# EAGLE schematic LorRaBaseBoard (EAGLE 9.6.2)
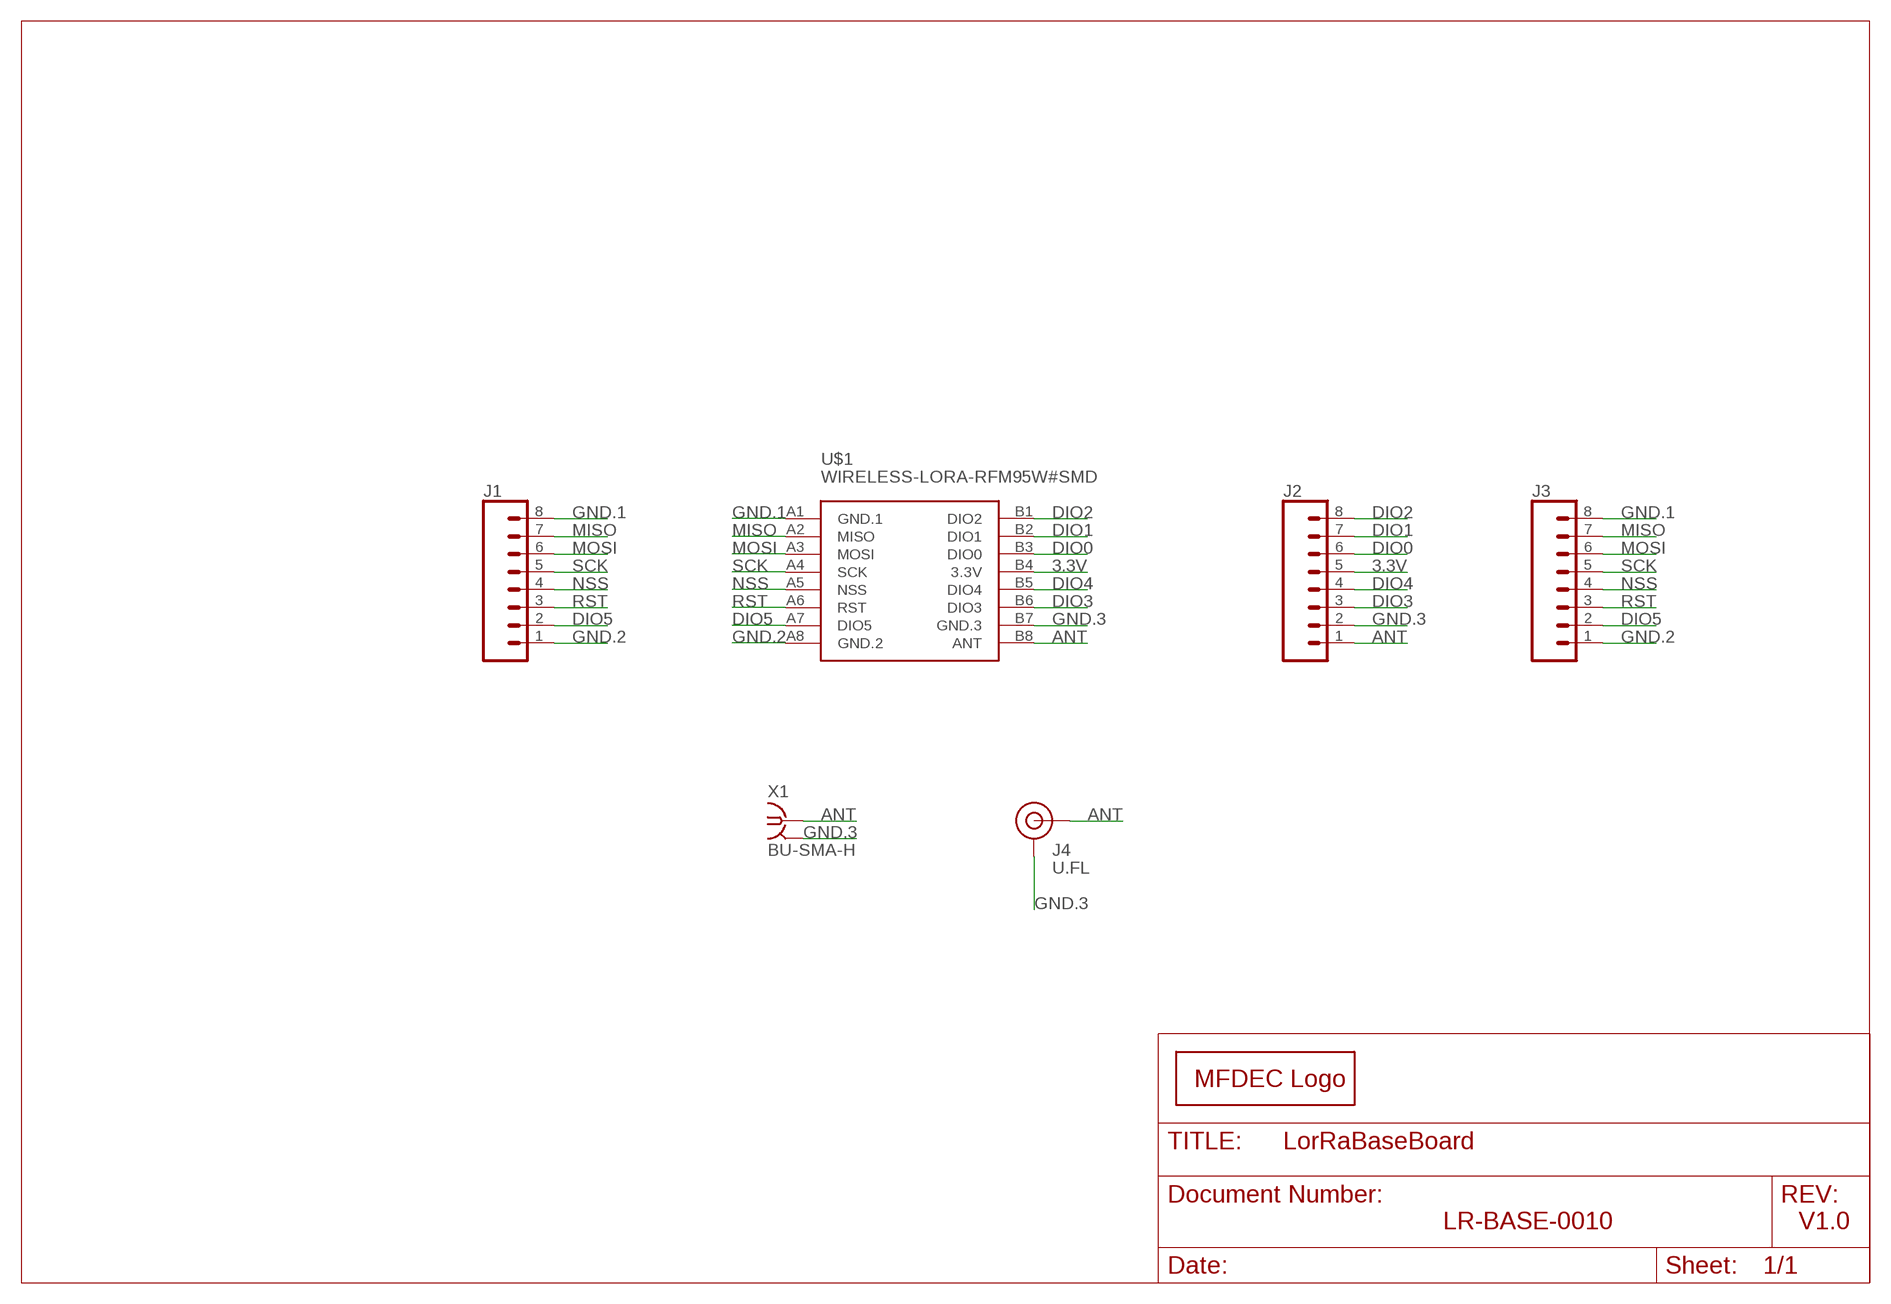
[diagram p0: schematic, sheet 1]

## Parts
J1  CONN_08NO_SILK_FEMALE_PTH  [1X08_NO_SILK]
J2  CONN_08NO_SILK_FEMALE_PTH  [1X08_NO_SILK]
J3  CONN_08NO_SILK_FEMALE_PTH  [1X08_NO_SILK]
J4  U.FL  U.FL2PIN  [U.FL]
LOGO1  MFDECLOGO_SQ_8MM  [MFDEC_SQ_8MM]
U$1  WIRELESS-LORA-RFM95W#SMD  [WIRELESS-LORA-RFM95W#SMD]
X1  BU-SMA-H  [BU-SMA-H]

## Nets
3.3V: J2.5 U$1.B4(3.3V)
ANT: J2.1 J4.FEED(SIGNAL) U$1.B8(ANT) X1.1
DIO0: J2.6 U$1.B3(DIO0)
DIO1: J2.7 U$1.B2(DIO1)
DIO2: J2.8 U$1.B1(DIO2)
DIO3: J2.3 U$1.B6(DIO3)
DIO4: J2.4 U$1.B5(DIO4)
DIO5: J1.2 J3.2 U$1.A7(DIO5)
GND.1: J1.8 J3.8 U$1.A1(GND.1)
GND.2: J1.1 J3.1 U$1.A8(GND.2)
GND.3: J2.2 J4.1(GND) J4.2(GND) U$1.B7(GND.3) X1.2 X1.3 X1.4 X1.5
MISO: J1.7 J3.7 U$1.A2(MISO)
MOSI: J1.6 J3.6 U$1.A3(MOSI)
NSS: J1.4 J3.4 U$1.A5(NSS)
RST: J1.3 J3.3 U$1.A6(RST)
SCK: J1.5 J3.5 U$1.A4(SCK)

## Notes on the sheet
- LR-BASE-0010 | V1.0

## Library data of the parts
J1-J3 = SparkFun-Connectors:CONN_08: Multi connection point. Often used as Generic Header-pin footprint for 0.1 inch spaced/style header connections On any of the 0.1 inch spaced packages, you can populate with these: Break Away Headers - Straight <https://www.sparkfun.com/products/116> (PRT-00116) Break Away Male Headers - Right Angle <https://www.sparkfun.com/products/553> (PRT-00553) Female Headers <https://www.sparkfun.com/products/115> (PRT-00115) Break Away Headers - Machine Pin <https://www.sparkfun.com/products/117> (PRT-00117) Break Away Female Headers - Swiss Machine Pin <https://www.sparkfun.com/products/743> (PRT-00743) Arduino Stackable Header - 8 Pin <https://www.sparkfun.com/products/9279> (PRT-09279) For SCREWTERMINALS and SPRING TERMINALS visit here: Screw Terimnals on SparkFun.com <https://www.sparkfun.com/search/results?term=Screw+Terminals> (5mm/3.5mm/2.54mm spacing) This device is also useful as a general connection point to wire up your design to another part of your project. Our various solder wires solder well into these plated through hole pads. Hook-Up Wire - Assortment (Stranded, 22 AWG) <https://www.sparkfun.com/products/11375> (PRT-11375) Hook-Up Wire - Assortment (Solid Core, 22 AWG) <https://www.sparkfun.com/products/11367> (PRT-11367) View the entire wire category on our website here <https://www.sparkfun.com/categories/141> Special notes: Molex polarized connector foot print use with SKU : PRT-08231 with associated crimp pins and housings. 1MM SMD Version SKU: PRT-10208 NOTES ON THE VARIANTS LOCK and LOCK_LONGPADS... This footprint was designed to help hold the alignment of a through-hole component (i.e. 6-pin header) while soldering it into place. You may notice that each hole has been shifted either up or down by 0.005 of an inch from it's more standard position (which is a perfectly straight line). This slight alteration caused the pins (the squares in the middle) to touch the edges of the holes. Because they are alternating, it causes a "brace" to hold the component in place. 0.005 has proven to be the perfect amount of "off-center" position when using our standard breakaway headers. Although looks a little odd when you look at the bare footprint, once you have a header in there, the alteration is very hard to notice. Also,if you push a header all the way into place, it is covered up entirely on the bottom side.; PROD_ID: CONN-08438
J4 = SparkFun-Connectors:U.FL2PIN: SMD Antenna Connector - U.FL 2mm height, 3.0mm x 3.0mm receptacle size. SparkFun Products: SparkFun WiFi Shield - ESP8266 <https://www.sparkfun.com/products/13287> SparkFun ESP8266 Thing <https://www.sparkfun.com/products/13231> SparkFun MiniGen - Pro Mini Signal Generator Shield <https://www.sparkfun.com/products/11420>; PROD_ID: CONN-09193; SF_ID: WRL-09144
LOGO1 = _my_logos:MFDECLOGO: Midnight Fog - Digital Eye Candy LOGO
U$1 = diy-modules:WIRELESS-LORA-RFM95W: 868/915 MHz LoRa Radio Transceiver Module based on SX1276 chip Click here to find device on ebay.com <http://www.ebay.com/sch/RFM95W+transceiver>
X1 = con-coax:BU-SMA-H: FEMALE SMA CONNECTOR Radiall; OC_FARNELL: unknown; OC_NEWARK: unknown